# Altium schematic sheet 1_P1.schdoc
size 431 x 309 mm; Symbol: Sheet-Symbol_A4; Device: Sheet-Symbol_A4; Company: 嘉立创EDA; Version: V1.0; Page Size: A4; @Project Name: 电子工程训练1; @Page Count: 1; @Update Date: 2024-05-22; @Create Date: 2024-05-21; @Schematic Name: Schematic1; @Page No: 1; @Page Name: P1
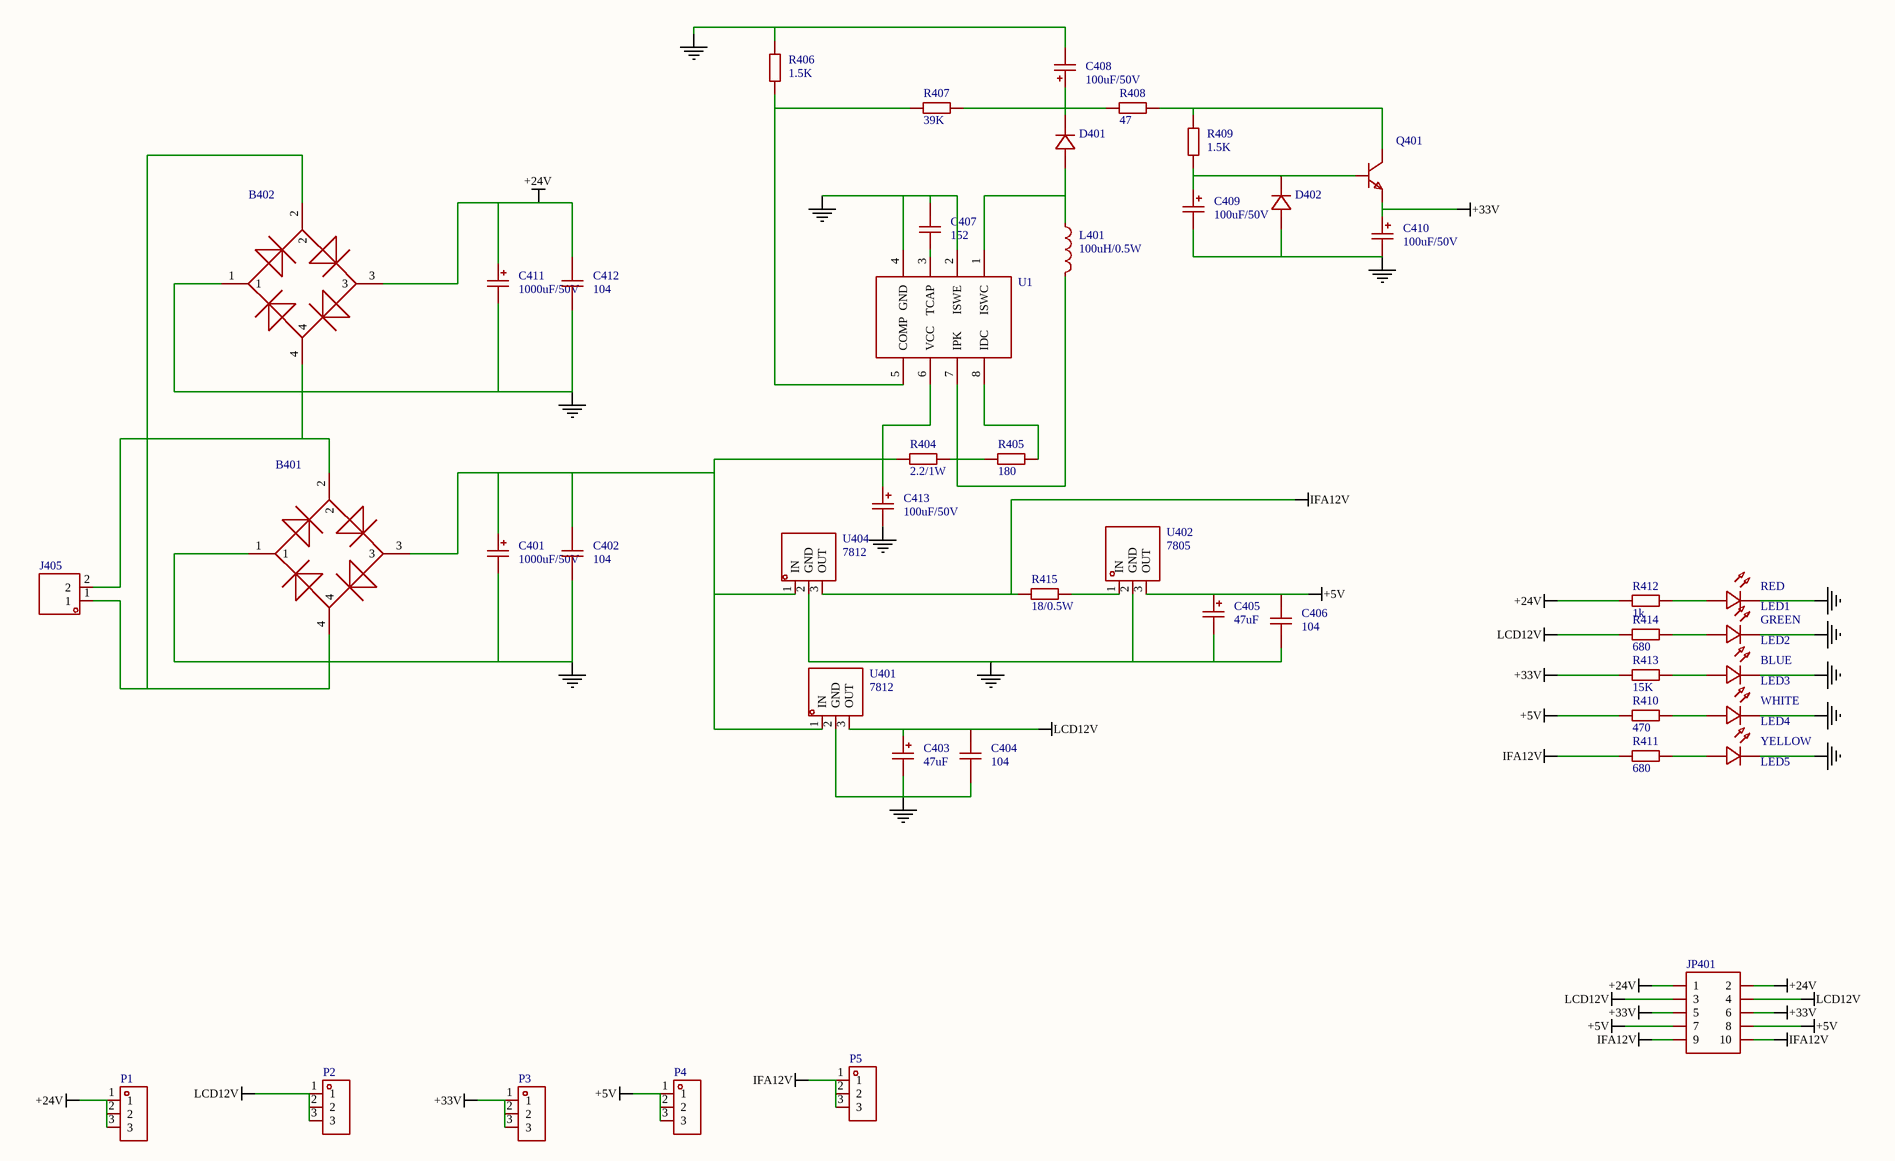
[diagram p0: 1_P1.schdoc]

## Parts
B401  (no value)  [B401/B402]
B402  (no value)  [B401/B402]
C401  1000uF/50V  [C401/C411]
C402  104  [RAD-0.2]
C403  47uF  [电解电容]
C404  104  [RAD-0.2]
C405  47uF  [电解电容]
C406  104  [RAD-0.2]
C407  152  [RAD-0.2]
C408  100uF/50V  [电解电容]
C409  100uF/50V  [电解电容]
C410  100uF/50V  [电解电容]
C411  1000uF/50V  [C401/C411]
C412  104  [RAD-0.2]
C413  100uF/50V  [电解电容]
D401  (no value)  [D401/D402]
D402  (no value)  [D401/D402]
J405  (no value)  [J405]
JP401  (no value)  [JP401]
L401  100uH/0.5W  [L401]
LED1  value RED  [LED]
LED2  value GREEN  [LED]
LED3  value BLUE  [LED]
LED4  value WHITE  [LED]
LED5  value YELLOW  [LED]
P1  (no value)  [HDR-TH_3P-P2.54-V-F]
P2  (no value)  [HDR-TH_3P-P2.54-V-F]
P3  (no value)  [HDR-TH_3P-P2.54-V-F]
P4  (no value)  [HDR-TH_3P-P2.54-V-F]
P5  (no value)  [HDR-TH_3P-P2.54-V-F]
Q401  (no value)  [Q401]
R404  2.2/1W  [Res_1/2W]
R405  180  [Res_1/4W]
R406  1.5K  [Res_1/4W]
R407  39K  [Res_1/4W]
R408  47  [Res_1/4W]
R409  1.5K  [Res_1/4W]
R410  470  [Res_1/4W]
R411  680  [Res_1/4W]
R412  1k  [Res_1/4W]
R413  15K  [Res_1/4W]
R414  680  [Res_1/4W]
R415  18/0.5W  [Res_1/2W]
U1  (no value)  [DIP-8_L10.0-W6.5-P2.54-LS7.6-BL-A]
U401  7812  [U401/U402/U404]
U402  7805  [U401/U402/U404]
U404  7812  [U401/U402/U404]

## Nets
+5V: C405.1 C406.2 JP401.7 JP401.8 P4.1 P4.2 P4.3 R410.1 U402.3(OUT)
+24V: B402.3 C411.1 C412.2 JP401.1 JP401.2 P1.1 P1.2 P1.3 R412.1
+33V: C410.1 JP401.5 JP401.6 P3.1 P3.2 P3.3 Q401.1 R413.1
GND: B401.1 B402.1 C401.2 C402.1 C403.2 C404.1 C405.2 C406.1 C407.2 C408.2 C409.2 C410.2 C411.2 C412.1 C413.2 D402.2(A) LED1.2(A) LED2.2(A) LED3.2(A) LED4.2(A) LED5.2(A) R406.2 U1.2(ISWE) U1.4(GND) U401.2(GND) U402.2(GND) U404.2(GND)
IFA12V: JP401.9 JP401.10 P5.1 P5.2 P5.3 R411.1 R415.2 U404.3(OUT)
LCD12V: C403.1 C404.2 JP401.3 JP401.4 P2.1 P2.2 P2.3 R414.1 U401.3(OUT)
NetB401_2: B401.2 B402.4 J405.2
NetB401_3: B401.3 C401.1 C402.2 C413.1 R404.2 U1.6(VCC) U401.1(IN) U404.1(IN)
NetB401_4: B401.4 B402.2 J405.1
NetC407_1: C407.1 U1.3(TCAP)
NetC408_1: C408.1 D401.1(K) R407.2 R408.1
NetC409_1: C409.1 D402.1(K) Q401.3 R409.1
NetD401_2: D401.2(A) L401.1 U1.1(ISWC)
NetL401_2: L401.2 R404.1 R405.1 U1.7(IPK)
NetLED1_1: LED1.1(C) R412.2
NetLED2_1: LED2.1(C) R414.2
NetLED3_1: LED3.1(C) R413.2
NetLED4_1: LED4.1(C) R410.2
NetLED5_1: LED5.1(C) R411.2
NetQ401_2: Q401.2 R408.2 R409.2
NetR405_2: R405.2 U1.8(IDC)
NetR406_1: R406.1 R407.1 U1.5(COMP)
NetR415_1: R415.1 U402.1(IN)

## Notes on the sheet
- 1
- 2
- 3
- 4
- 5
- 6
- A
- B
- C
- D
- 原理图
- Schematic1
- 创建日期
- 更新日期
- 2024-05-22
- 2024-05-21
- 审阅
- 绘制
- 图页
- P1
- 物料编码
- 电子工程训练1
- 版本
- 尺寸
- 页
- 共
- V1.0
- A4
- 嘉立创EDA

## Library data of the parts
B401 B402 = 整流桥: Add into BOM: yes; Symbol: 整流桥; Device: 整流桥; Convert to PCB: yes
C401 C403 C405 C408-C411 C413 = C_Ele_SMD_3x5.4mm: Symbol: CAP; Add into BOM: yes; Device: C_Ele_SMD_3x5.4mm; Supplier Footprint: SMD,3x5.4mm; Convert to PCB: yes
  C401 C411: Value: 1000uF/50V
  C403 C405: Value: 47uF
  C408-C410 C413: Value: 100uF/50V
C402 C404 C406 C407 C412 = CAP_0603: Symbol: CapAcitance; Convert to PCB: yes; Device: CAP_0603; Add into BOM: yes; Supplier Footprint: 0603
  C402 C404 C406 C412: Value: 104
  C407: Value: 152
D401 D402 = D_1N4007A: Add into BOM: yes; Symbol: D_1N4007; Device: D_1N4007A; Supplier Footprint: DO-41; Convert to PCB: yes
J405 = HDR-M_2.54_1x2P: Manufacturer: Ckmtw(灿科盟); Manufacturer Part: B-2100S02P-A110; Symbol: 210S-1*2P L=11.6MMGold-plated black; Convert to PCB: yes; Device: HDR-M_2.54_1x2P; Supplier: LCSC; Supplier Part: C124375; JLCPCB Part Class: Extended Part; Add into BOM: yes; Supplier Footprint: 插件
JP401 = HDR-F_2.54_2x5: Symbol: HDR-F-2.54_2x5; Convert to PCB: yes; Device: HDR-F_2.54_2x5; Add into BOM: yes; Supplier Part: C92270; Supplier Footprint: 插件
L401 = L_0603: Symbol: SDFL1608S100KTF; Add into BOM: yes; Device: L_0603; Supplier Footprint: L0603; Convert to PCB: yes; Value: 100uH/0.5W
LED1-LED5 = LED_TH-R_3mm: Convert to PCB: yes; Symbol: LED_TH-R; Device: LED_TH-R_3mm; Add into BOM: yes; Supplier Footprint: 插件
P1-P5 = HDR-F_2.54_1x3P: Symbol: PM254V-11-03-H85; Convert to PCB: yes; Device: HDR-F_2.54_1x3P; Add into BOM: yes; Supplier Part: C541850; Supplier Footprint: 插件
Q401 = S8050_SOT_NPN: Symbol: NPN; Convert to PCB: yes; Device: S8050_SOT_NPN; Add into BOM: yes; Supplier Footprint: SOT-23
R404-R415 = Res_AXIAL-1/4W: Symbol: 电阻; Add into BOM: yes; Device: Res_AXIAL-1/4W; Supplier Footprint: 轴向引线; Convert to PCB: yes
  R404: Value: 2.2/1W
  R405: Value: 180
  R406 R409: Value: 1.5K
  R407: Value: 39K
  R408: Value: 47
  R410: Value: 470
  R411 R414: Value: 680
  R412: Value: 1k
  R413: Value: 15K
  R415: Value: 18/0.5W
U1 = MC34063: Add into BOM: yes; Symbol: MC34063; Device: MC34063; Convert to PCB: yes
U401 U404 = 7812: Manufacturer: BLUE ROCKET(蓝箭); Add into BOM: yes; Output Type: 固定; Maximum Input Voltage: 35V; Output Voltage: 12V; MAX Output Current: 1.5A; Power Supply Rejection Ratio (PSRR): 55dB@(120Hz); Dropout Voltage: 2V@(1A); Output Polarity: 正极; Number of Outputs: 1; Symbol: 7812; Device: 7812; Supplier: LCSC; Supplier Part: C358369; Manufacturer Part: 7812; JLCPCB Part Class: 扩展库; LCSC Part Name: 输入35V 输出12V 1.5A; Supplier Footprint: TO-220; Datasheet: https://atta.szlcsc.com/upload/public/pdf/source/20190129/C358369_76FC1BF920F4FC034B3298D16553EF92.pdf; Convert to PCB: yes
U402 = 7805: Manufacturer: SY(顺烨）; Symbol: 7805_C4944936; Add into BOM: yes; Output Type: 固定; Maximum Input Voltage: 35V; Output Voltage: 5V; MAX Output Current: 1.5A; Power Supply Rejection Ratio (PSRR): 62dB@(120Hz); Output Polarity: 正极; Device: 7805; Supplier: LCSC; Supplier Part: C4944936; Manufacturer Part: 7805; JLCPCB Part Class: 扩展库; LCSC Part Name: 输入35V 输出5V 1.5A; Supplier Footprint: TO-220AB; Datasheet: https://atta.szlcsc.com/upload/public/pdf/source/20220719/323A3F14557C229271C454C7C0F759A5.pdf; Convert to PCB: yes; Dropout Voltage: -; standby current: -; Noise: -; Feature: -; Operating Temperature: -; Number of Outputs: -